# Altium schematic sheet power-io.SchDoc: Test
size A4; DrawnBy: Łukasz Przeniosło; Organization: Apptimia sp. z o.o.; Address1: Wojska Polskiego 184c/4; Address2: 71-256 Szczecin; Address3: www.apptimia.com; DocumentNumber: 3; Revision: 1; SheetNumber: 3; SheetTotal: 12
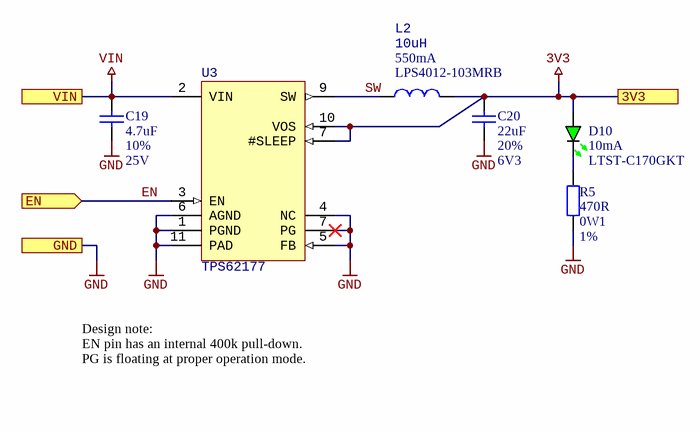
[diagram p0: power-io.SchDoc]

## Parts
C19  4.7uF  Tolerance: 10%  Voltage: 25V  [CAPC2012N]
C20  22uF  Tolerance: 20%  Voltage: 6V3  [CAPC2012N]
D10  Current: 10mA  manid: LTST-C170GKT  [CD2012-0805-GRN]  (hidden comment: Led Green)
L2  10uH  Current: 550mA  manid: LPS4012-103MRB  [LPS4012]
R5  470R  Power: 0W1  Tolerance: 1%  [RESC1608N]
U3  TPS62177  [WSON10]

## Ports
3V3, EN (in), GND, VIN

## Nets
3V3: C20.2 D10.1(A) L2.1 U3.7(#SLEEP) U3.10(VOS) ; port 3V3
GND: C19.1 C20.1 R5.1 U3.1(PGND) U3.4(NC) U3.5(FB) U3.6(AGND) U3.7(PG) U3.11(PAD) ; port GND
VIN: C19.2 U3.2(VIN) ; port VIN
EN: U3.3(EN) ; port EN
SW: L2.2 U3.9(SW)
NetD10_2: D10.2(K) R5.2

## Notes on the sheet
- Design note:
  EN pin has an internal 400k pull-down.
  PG is floating at proper operation mode.
- Title
- Size:
- Date:
- A4
- Author:
- Time:
- Sheet
- of
- File:

## Library data of the parts
C19 C20 = Capacitor
  C19: Value: 4.7uF
  C20: Value: 22uF
D10 = Led Green: Typical GRN LED
L2 = Inductor: Impedance_100Mhz: 40R; Value: 10uH
R5 = Resistor: Value: 470R
U3 = TPS6217x: TPS6217x 28-V, 0.5-A Step-Down Converter With Sleep Mode; manid: TPS62177